# EAGLE design MD201x_2018-11-25 (EAGLE 9.2.2)

## Sheet 1 of 4
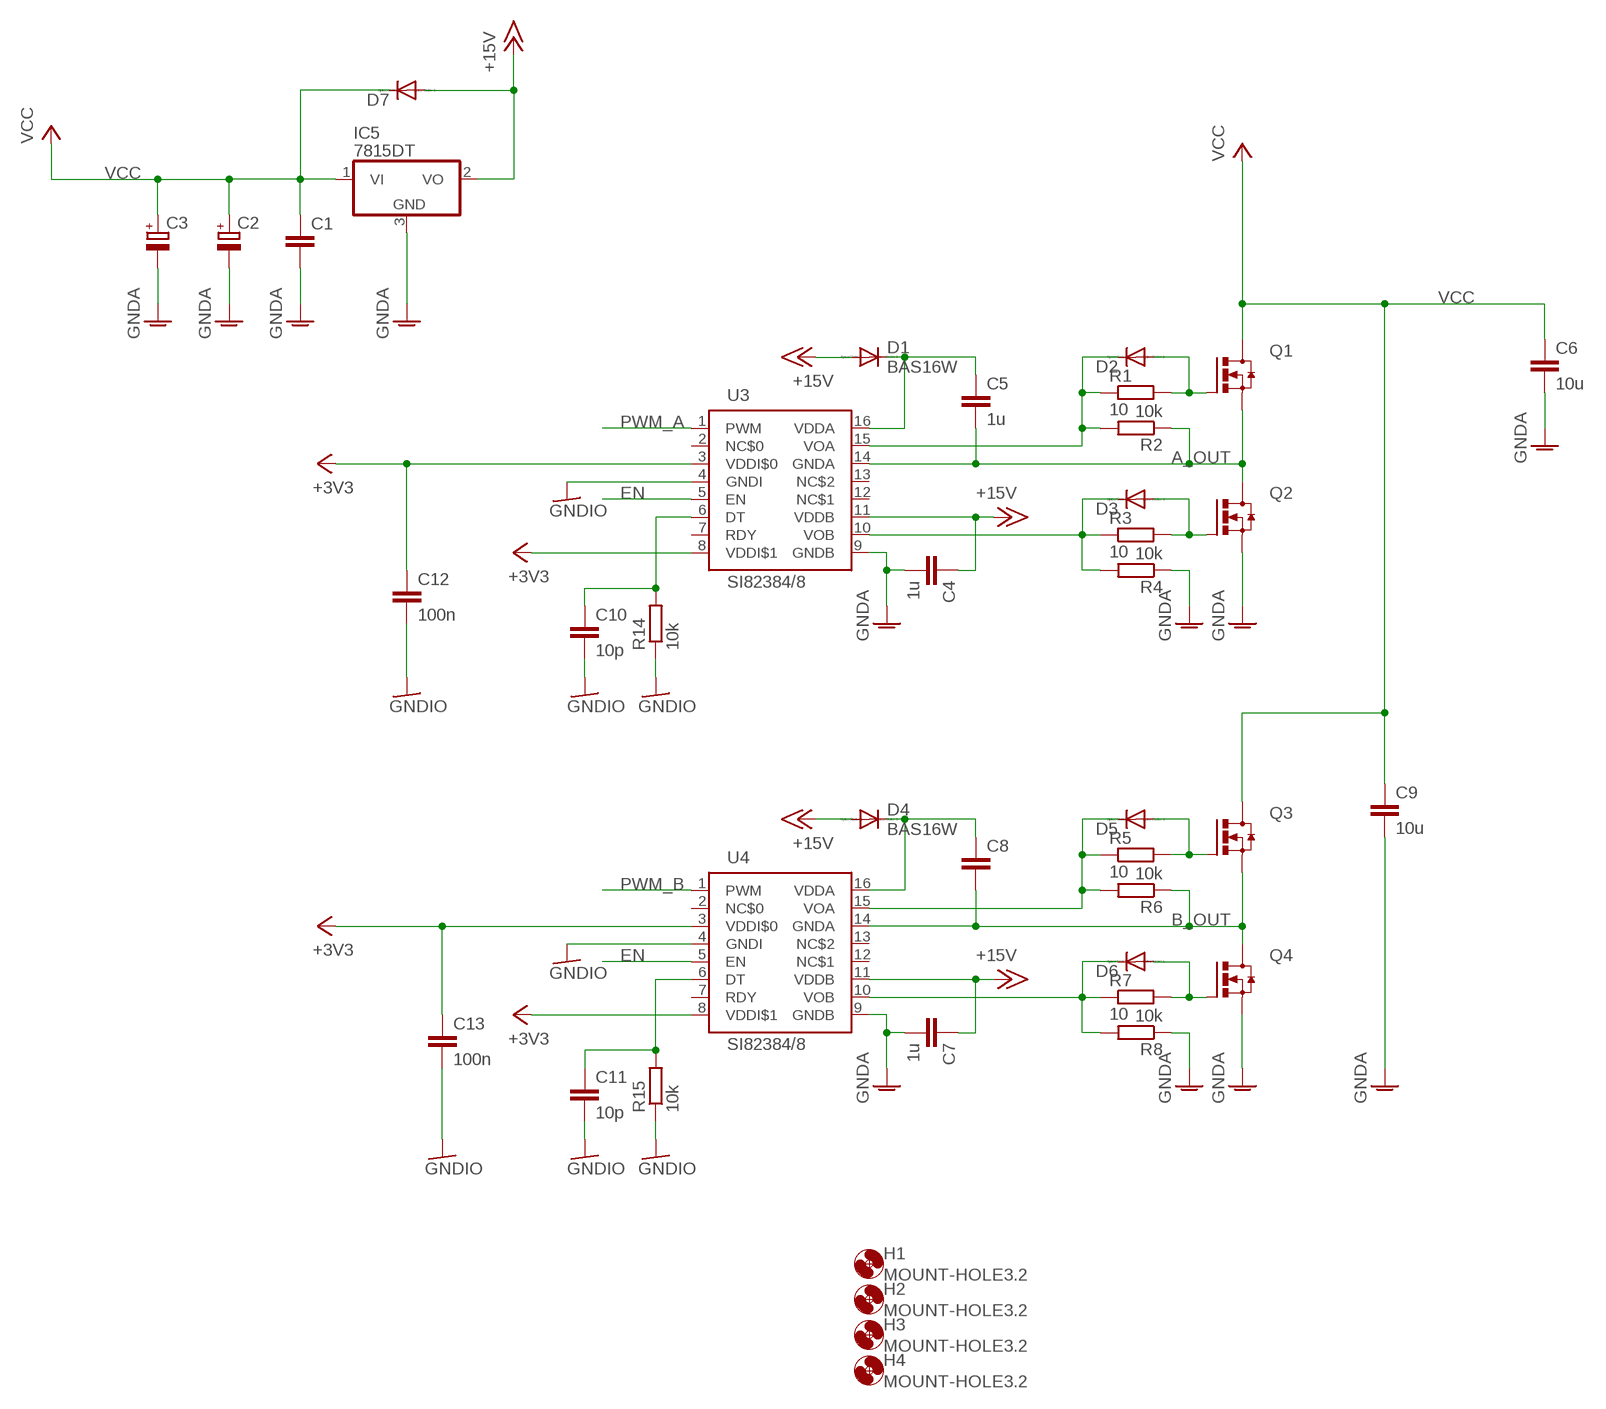
[diagram p0: schematic, sheet 1]

### Parts
C1  C-EUC0805  [C0805]
C2  CPOL-EUE3.5-8  [E3,5-8]
C3  CPOL-EUE3.5-8  [E3,5-8]
C4  1u  C-EUC0805  [C0805]
C5  1u  C-EUC0805  [C0805]
C6  10u  C-EUC1210  [C1210]
C7  1u  C-EUC0805  [C0805]
C8  C-EUC0805  [C0805]
C9  10u  C-EUC1210  [C1210]
C10  10p  C-EUC0603  [C0603]
C11  10p  C-EUC0603  [C0603]
C12  100n  C-EUC0603  [C0603]
C13  100n  C-EUC0603  [C0603]
D1  BAS16W  DIODE-SOD323-R  [SOD323-R]
D2  DIODE-SOD523  [SOD523]
D3  DIODE-SOD523  [SOD523]
D4  BAS16W  DIODE-SOD323-R  [SOD323-R]
D5  DIODE-SOD523  [SOD523]
D6  DIODE-SOD523  [SOD523]
D7  DIODE-SOD323-R  [SOD323-R]
H1  MOUNT-HOLE3.2  [3,2]
H2  MOUNT-HOLE3.2  [3,2]
H3  MOUNT-HOLE3.2  [3,2]
H4  MOUNT-HOLE3.2  [3,2]
IC5  7815DT  [TO252]
Q1  -N_MOSFET-SOT669  [SOT669]
Q2  -N_MOSFET-SOT669  [SOT669]
Q3  -N_MOSFET-SOT669  [SOT669]
Q4  -N_MOSFET-SOT669  [SOT669]
R1  10  R-EU_R0603  [R0603]
R2  10k  R-EU_R0603  [R0603]
R3  10  R-EU_R0603  [R0603]
R4  10k  R-EU_R0603  [R0603]
R5  10  R-EU_R0603  [R0603]
R6  10k  R-EU_R0603  [R0603]
R7  10  R-EU_R0603  [R0603]
R8  10k  R-EU_R0603  [R0603]
R14  10k  R-EU_R0603  [R0603]
R15  10k  R-EU_R0603  [R0603]
U3  SI82384/8  [SOIC16]
U4  SI82384/8  [SOIC16]

### Nets
+3V3: C12.1 C13.1 U3.3(VDDI$0) U3.8(VDDI$1) U4.3(VDDI$0) U4.8(VDDI$1) ; also sheet 3,4
+15V: C4.1 C7.1 D1.A D4.A D7.A IC5.2(VO) U3.11(VDDB) U4.11(VDDB)
A_OUT: C5.2 Q1.1(SOURCE) Q1.2(SOURCE) Q1.3(SOURCE) Q2.5(DRAIN) R2.1 U3.14(GNDA)
B_OUT: C8.2 Q3.1(SOURCE) Q3.2(SOURCE) Q3.3(SOURCE) Q4.5(DRAIN) R6.1 U4.14(GNDA)
EN: U3.5(EN) U4.5(EN) ; also sheet 3
GNDA: C1.2 C2.- C3.- C4.2 C6.2 C7.2 C9.2 IC5.3(GND) Q2.1(SOURCE) Q2.2(SOURCE) Q2.3(SOURCE) Q4.1(SOURCE) Q4.2(SOURCE) Q4.3(SOURCE) R4.1 R8.1 U3.9(GNDB) U4.9(GNDB)
GNDIO: C10.2 C11.2 C12.2 C13.2 R14.1 R15.1 U3.4(GNDI) U4.4(GNDI) ; also sheet 2,3,4
N$1: D2.C R1.1 R2.2 U3.15(VOA)
N$2: D5.C R5.1 R6.2 U4.15(VOA)
N$4: D2.A Q1.4(GATE) R1.2
N$5: D6.C R7.1 R8.2 U4.10(VOB)
N$6: C10.1 R14.2 U3.6(DT)
N$9: C11.1 R15.2 U4.6(DT)
N$11: D3.C R3.1 R4.2 U3.10(VOB)
N$13: D5.A Q3.4(GATE) R5.2
N$61: D3.A Q2.4(GATE) R3.2
N$64: D6.A Q4.4(GATE) R7.2
N$67: C8.1 D4.C U4.16(VDDA)
N$73: C5.1 D1.C U3.16(VDDA)
PWM_A: U3.1(PWM) ; also sheet 3
PWM_B: U4.1(PWM) ; also sheet 3
VCC: C1.1 C2.+ C3.+ C6.1 C9.1 D7.C IC5.1(VI) Q1.5(DRAIN) Q3.5(DRAIN)
Unconnected: U3.2(NC$0) U3.7(RDY) U3.12(NC$1) U3.13(NC$2) U4.2(NC$0) U4.7(RDY) U4.12(NC$1) U4.13(NC$2)

## Sheet 2 of 4
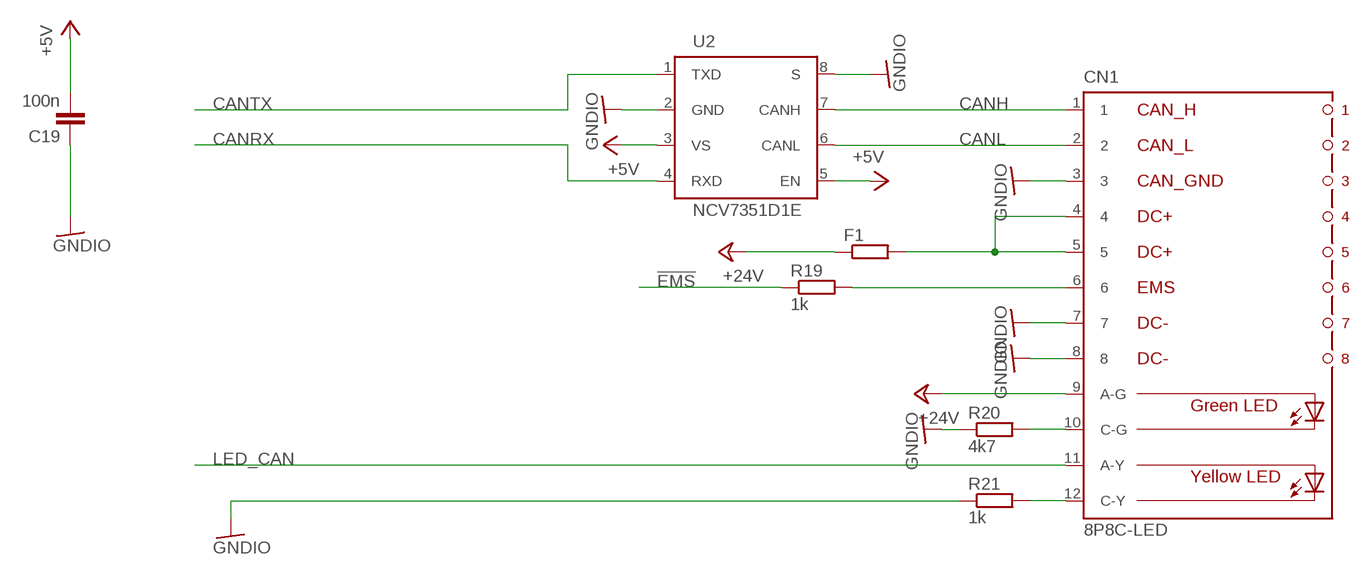
[diagram p1: schematic, sheet 2]

### Parts
C19  100n  C-EUC0603  [C0603]
CN1  8P8C-LED  [8P8C-LED]
F1  R-EU_R1206  [R1206]
R19  1k  R-EU_R0603  [R0603]
R20  4k7  R-EU_R0603  [R0603]
R21  1k  R-EU_R0603  [R0603]
U2  NCV7351D1E  [SO08]

### Nets
!EMS: R19.1 ; also sheet 3
!EMS_ISO: CN1.6 R19.2
+5V: C19.2 U2.3(VS) U2.5(EN) ; also sheet 3,4
+24V: CN1.9(A-G) F1.1 ; also sheet 4
CANH: CN1.1 U2.7(CANH)
CANL: CN1.2 U2.6(CANL)
CANRX: U2.4(RXD) ; also sheet 3
CANTX: U2.1(TXD) ; also sheet 3
GNDIO: C19.1 CN1.3 CN1.7 CN1.8 R20.1 R21.1 U2.2(GND) U2.8(S) ; also sheet 1,3,4
LED_CAN: CN1.11(A-Y) ; also sheet 3
N$8: CN1.4 CN1.5 F1.2
N$18: CN1.10(C-G) R20.2
N$20: CN1.12(C-Y) R21.2

## Sheet 3 of 4
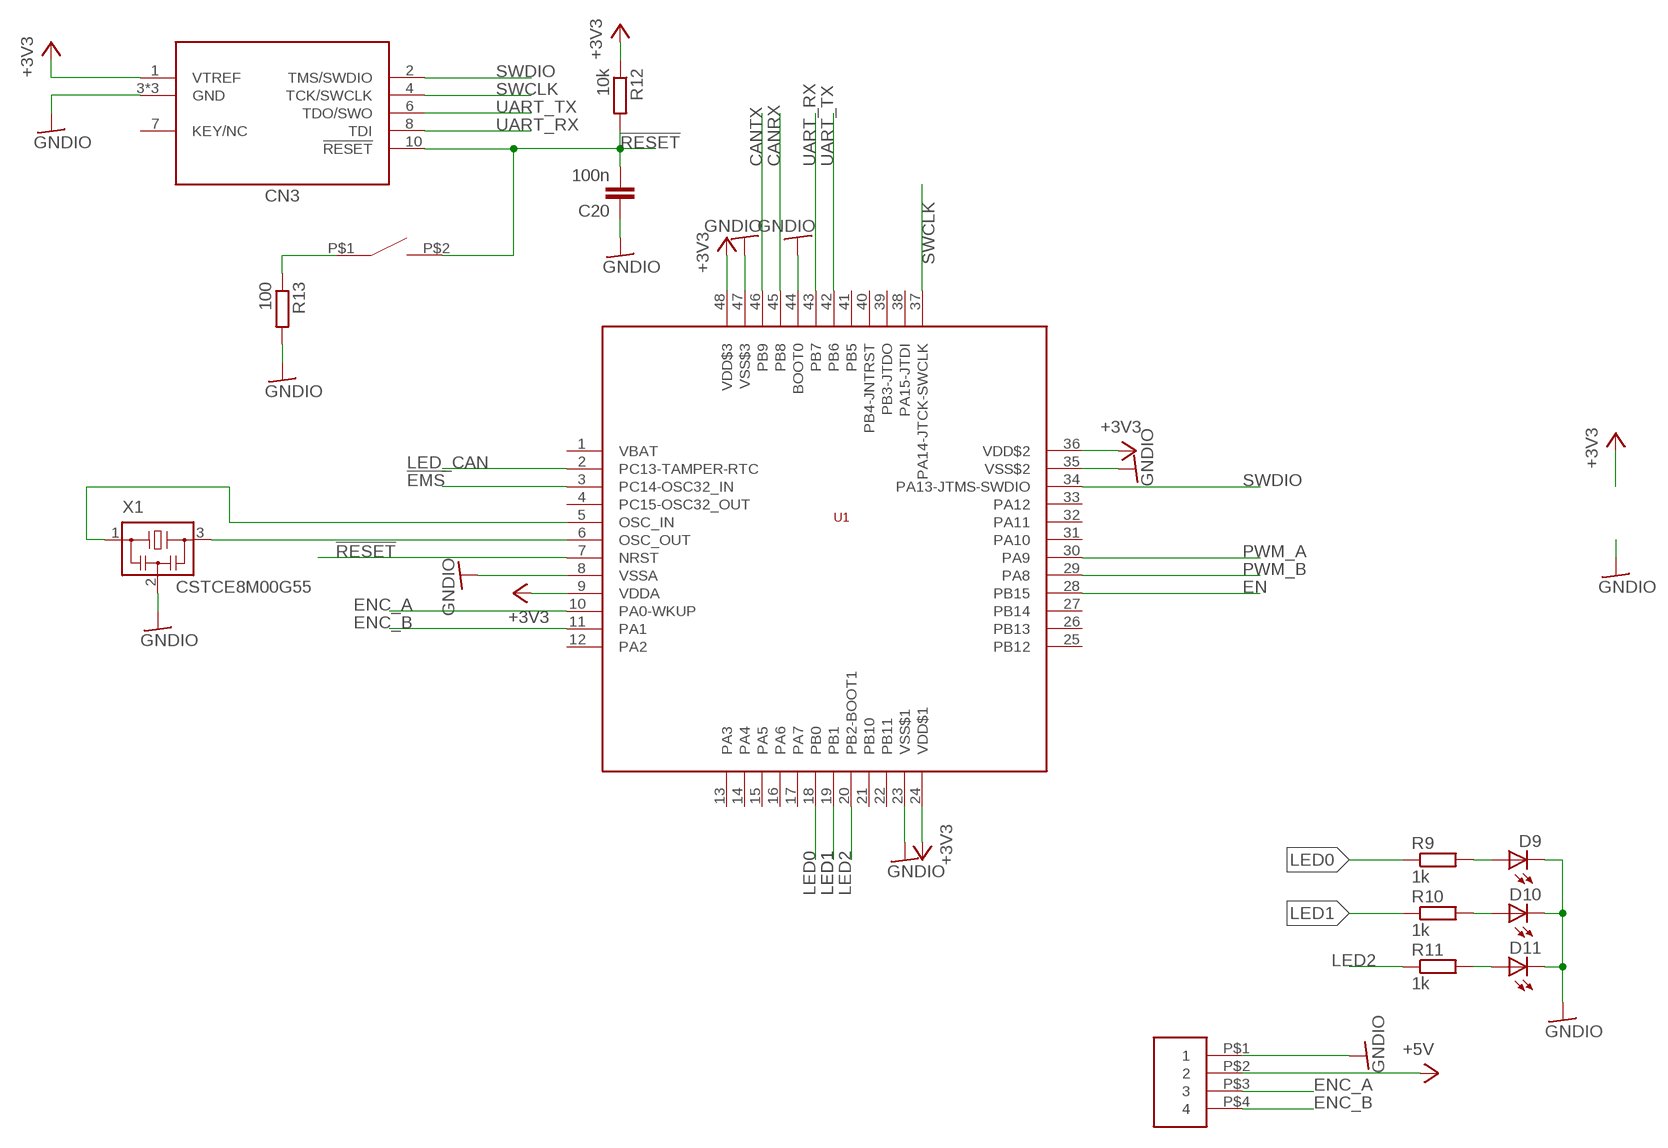
[diagram p2: schematic, sheet 3]

### Parts
C20  100n  C-EUC0603  [C0603]
CN2  XH-4-SIDE  [CON-XH-4-SIDE]
CN3  CON_SWD_1.27_SMD  [CON_SWD_1.27_SMD]
D9  LEDCHIPLED_0805  [CHIPLED_0805]
D10  LEDCHIPLED_0805  [CHIPLED_0805]
D11  LEDCHIPLED_0805  [CHIPLED_0805]
R9  1k  R-EU_R0603  [R0603]
R10  1k  R-EU_R0603  [R0603]
R11  1k  R-EU_R0603  [R0603]
R12  10k  R-EU_R0603  [R0603]
R13  100  R-EU_R0603  [R0603]
SW1  SWITCH_TACTILETOP  [SWITCH_TACTILE_3X6]
U1  STM32F103C8  [LQFP48]
X1  CSTCE8M00G55  [CSTCE8M00G55]

### Nets
!EMS: U1.3(PC14-OSC32_IN) ; also sheet 2
!RESET: C20.2 CN3.10(!RESET) R12.2 SW1.P$2 U1.7(NRST)
+3V3: CN3.1(VTREF) R12.1 U1.9(VDDA) U1.24(VDD$1) U1.36(VDD$2) U1.48(VDD$3) ; also sheet 1,4
+5V: CN2.P$2 ; also sheet 2,4
CANRX: U1.45(PB8) ; also sheet 2
CANTX: U1.46(PB9) ; also sheet 2
EN: U1.28(PB15) ; also sheet 1
ENC_A: CN2.P$3 U1.10(PA0-WKUP)
ENC_B: CN2.P$4 U1.11(PA1)
GNDIO: C20.1 CN2.P$1 CN3.3(GND) CN3.5(GND) CN3.9(GND) D9.C D10.C D11.C R13.2 U1.8(VSSA) U1.23(VSS$1) U1.35(VSS$2) U1.44(BOOT0) U1.47(VSS$3) X1.2 ; also sheet 1,2,4
LED0: R9.1 U1.18(PB0)
LED1: R10.1 U1.19(PB1)
LED2: R11.1 U1.20(PB2-BOOT1)
LED_CAN: U1.2(PC13-TAMPER-RTC) ; also sheet 2
N$3: D10.A R10.2
N$7: D9.A R9.2
N$10: U1.6(OSC_OUT) X1.3
N$16: R13.1 SW1.P$1
N$19: U1.5(OSC_IN) X1.1
N$21: D11.A R11.2
PWM_A: U1.30(PA9) ; also sheet 1
PWM_B: U1.29(PA8) ; also sheet 1
SWCLK: CN3.4(TCK/SWCLK) U1.37(PA14-JTCK-SWCLK)
SWDIO: CN3.2(TMS/SWDIO) U1.34(PA13-JTMS-SWDIO)
UART_RX: CN3.8(TDI) U1.43(PB7)
UART_TX: CN3.6(TDO/SWO) U1.42(PB6)
Unconnected: CN3.7(KEY/NC) U1.1(VBAT) U1.4(PC15-OSC32_OUT) U1.12(PA2) U1.13(PA3) U1.14(PA4) U1.15(PA5) U1.16(PA6) U1.17(PA7) U1.21(PB10) U1.22(PB11) U1.25(PB12) U1.26(PB13) U1.27(PB14) U1.31(PA10) U1.32(PA11) U1.33(PA12) U1.38(PA15-JTDI) U1.39(PB3-JTDO) U1.40(PB4-JNTRST) U1.41(PB5)

## Sheet 4 of 4
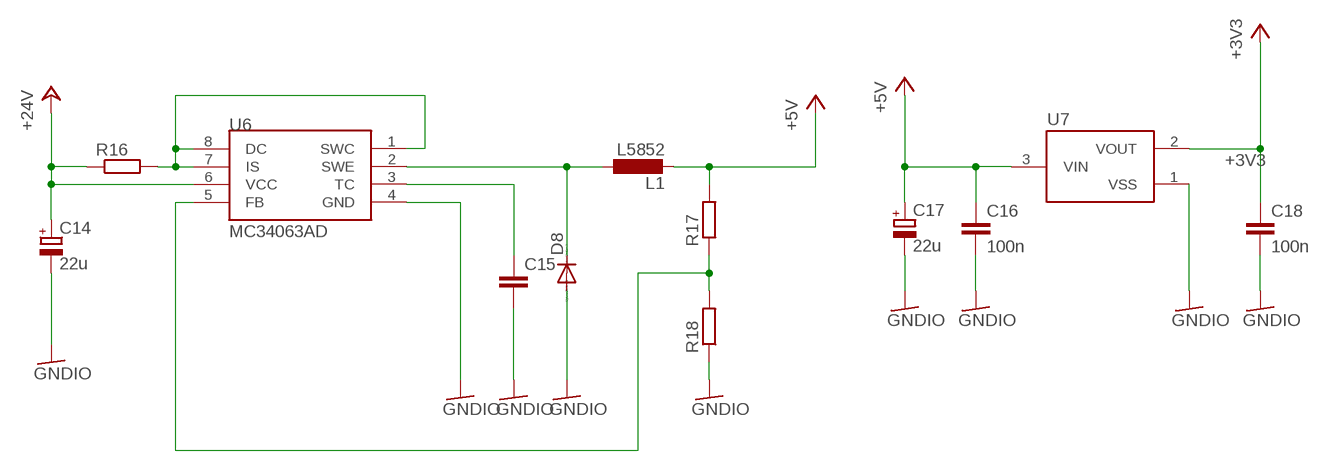
[diagram p3: schematic, sheet 4]

### Parts
C14  22u  CPOL-EUE2-5  [E2-5]
C15  C-EUC0603  [C0603]
C16  100n  C-EUC0603  [C0603]
C17  22u  CPOL-EUE2-5  [E2-5]
C18  100n  C-EUC0603  [C0603]
D8  DIODE-SOD123  [SOD123]
L1  L5852  [L5852]
R16  R-EU_R1206  [R1206]
R17  R-EU_R0603  [R0603]
R18  R-EU_R0603  [R0603]
U6  MC34063AD  [SOIC8]
U7  XC6206  [SOT95P240X110-3]

### Nets
+3V3: C18.1 U7.2(VOUT) ; also sheet 1,3
+5V: C16.1 C17.+ L1.P$2 R17.2 U7.3(VIN) ; also sheet 2,3
+24V: C14.+ R16.1 U6.6(VCC) ; also sheet 2
GNDIO: C14.- C15.2 C16.2 C17.- C18.2 D8.A R18.1 U6.4(GND) U7.1(VSS) ; also sheet 1,2,3
N$12: R16.2 U6.1(SWC) U6.7(IS) U6.8(DC)
N$14: D8.C L1.P$1 U6.2(SWE)
N$15: C15.1 U6.3(TC)
N$17: R17.1 R18.2 U6.5(FB)

## Library data of the parts
C1 C4-C13 C16 C18-C20 = rcl:C-EU: CAPACITOR, European symbol
C2 C3 C14 C17 = rcl:CPOL-EU: POLARIZED CAPACITOR, European symbol
C15 = rcl:C-EU: CAPACITOR, European symbol; SPICEPREFIX: C
CN1 = con-rj45:8P8C-LED: generic 8P8C connector with two LED's; OC_FARNELL: unknown; OC_NEWARK: unknown
CN2 = con-xh:XH-4-SIDE
CN3 = con-swd:CON_SWD_1.27_SMD
D1-D8 = diode:DIODE-: DIODE
D9-D11 = led:LED: LED OSRAM: - CHIPLED LG R971, LG N971, LY N971, LG Q971, LY Q971, LO R971, LY R971 LH N974, LH R974 LS Q976, LO Q976, LY Q976 LO Q996 - Hyper CHIPLED LW Q18S LB Q993, LB Q99A, LB R99A - SideLED LS A670, LO A670, LY A670, LG A670, LP A670 LB A673, LV A673, LT A673, LW A673 LH A674 LY A675 LS A676, LA A676, LO A676, LY A676, LW A676 LS A679, LY A679, LG A679 - Hyper Micro SIDELED® LS Y876, LA Y876, LO Y876, LY Y876 LT Y87S - SmartLED LW L88C, LW L88S LB L89C, LB L89S, LG L890 LS L89K, LO L89K, LY L89K LS L896, LA L896, LO L896, LY L896 - TOPLED LS T670, LO T670, LY T670, LG T670, LP T670 LSG T670, LSP T670, LSY T670, LOP T670, LYG T670 LG T671, LOG T671, LSG T671 LB T673, LV T673, LT T673, LW T673 LH T674 LS T676, LA T676, LO T676, LY T676, LB T676, LH T676, LSB T676, LW T676 LB T67C, LV T67C, LT T67C, LS T67K, LO T67K, LY T67K, LW E67C LS E67B, LA E67B, LO E67B, LY E67B, LB E67C, LV E67C, LT E67C LW T67C LS T679, LY T679, LG T679 LS T770, LO T770, LY T770, LG T770, LP T770 LB T773, LV T773, LT T773, LW T773 LH T774 LS E675, LA E675, LY E675, LS T675 LS T776, LA T776, LO T776, LY T776, LB T776 LHGB T686 LT T68C, LB T68C - Hyper Mini TOPLED® LB M676 - Mini TOPLED Santana® LG M470 LS M47K, LO M47K, LY M47K Source: http://www.osram.convergy.de LUXEON: - LUMILED® LXK2-PW12-R00, LXK2-PW12-S00, LXK2-PW14-U00, LXK2-PW14-V00 LXK2-PM12-R00, LXK2-PM12-S00, LXK2-PM14-U00 LXK2-PE12-Q00, LXK2-PE12-R00, LXK2-PE12-S00, LXK2-PE14-T00, LXK2-PE14-U00 LXK2-PB12-K00, LXK2-PB12-L00, LXK2-PB12-M00, LXK2-PB14-N00, LXK2-PB14-P00, LXK2-PB14-Q00 LXK2-PR12-L00, LXK2-PR12-M00, LXK2-PR14-Q00, LXK2-PR14-R00 LXK2-PD12-Q00, LXK2-PD12-R00, LXK2-PD12-S00 LXK2-PH12-R00, LXK2-PH12-S00 LXK2-PL12-P00, LXK2-PL12-Q00, LXK2-PL12-R00 Source: www.luxeon.com KINGBRIGHT: KA-3528ASYC Source: www.kingbright.com
F1 R16-R21 = rcl:R-EU_: RESISTOR, European symbol; SPICEPREFIX: R
H1-H4 = holes:MOUNT-HOLE: MOUNTING HOLE with drill center marker
IC5 = linear:78*: Positive VOLTAGE REGULATOR Source: http://cache.national.com/ds/LM/LM78L05.pdf http://www.fairchildsemi.com/ds/LM/LM7805.pdf
L1 = l_ysk:L5852
Q1-Q4 = transistor:*-N_MOSFET-
R1-R15 = rcl:R-EU_: RESISTOR, European symbol
SW1 = switch-tactile:SWITCH_TACTILE
U1 = stm32_mcu:STM32F103C8: STMicroelectronics STM32F103C8 Mainstream Performance line, ARM Cortex-M3 MCU with 64 Kbytes Flash, 72 MHz CPU, motor control, USB and CAN references: datasheet <https://www.st.com/resource/en/datasheet/stm32f103c8.pdf> product page <https://www.st.com/ja/microcontrollers/stm32f103c8.html>
U2 = on-semi:NCV7351D1E: High Speed CAN Transceiver Source: NCV7351-D.PDF <http://www.onsemi.com/PowerSolutions/document/NCV7351-D.PDF>
U3 U4 = silabs:SI82384/8
U6 = mc34063:MC34063
U7 = torex:XC6206
X1 = resonator:CSTCE8M00G55

## Board
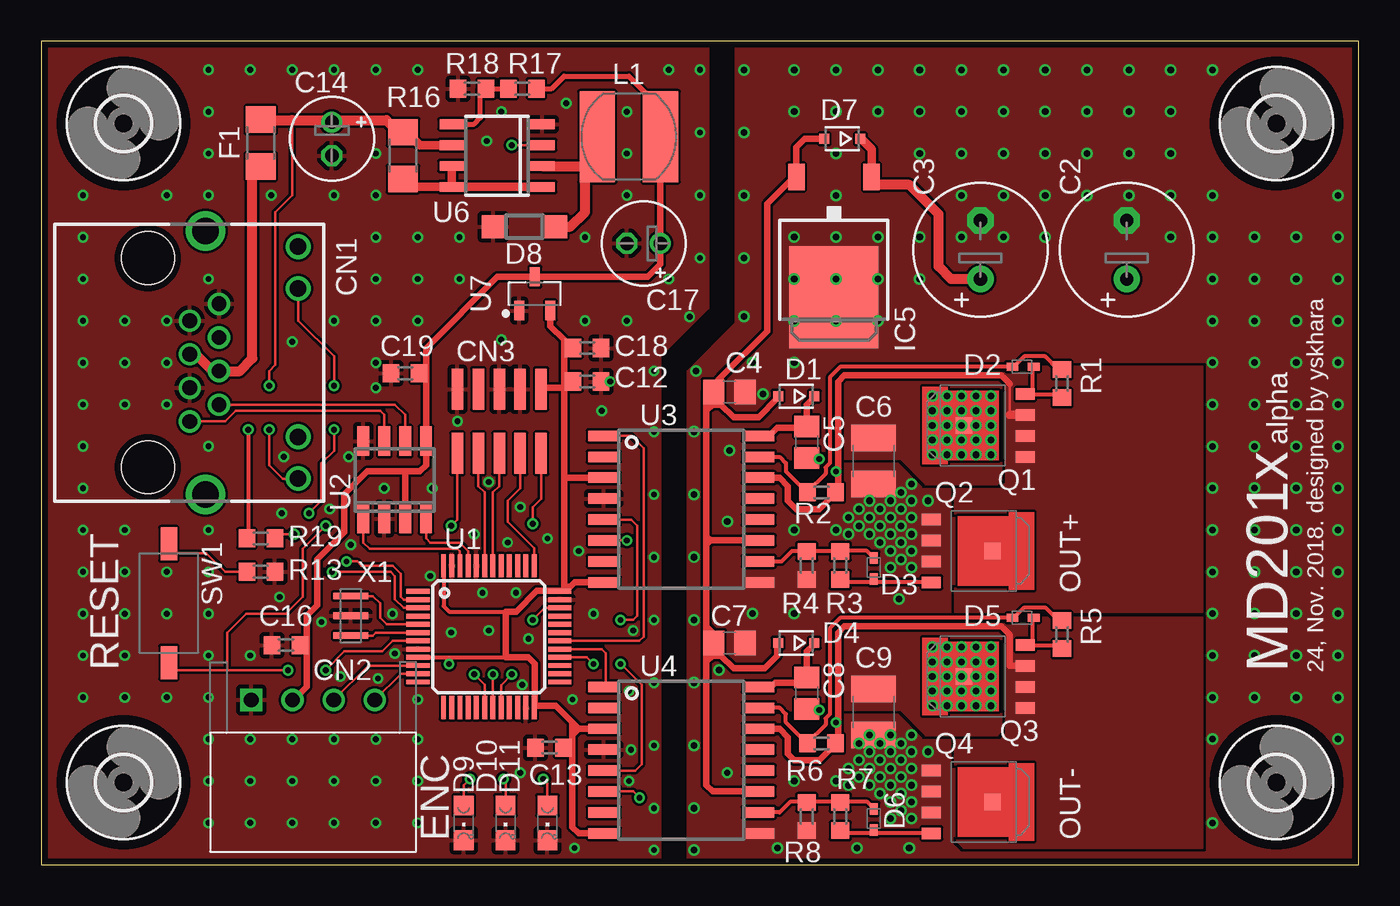
[diagram p4: board, top side]
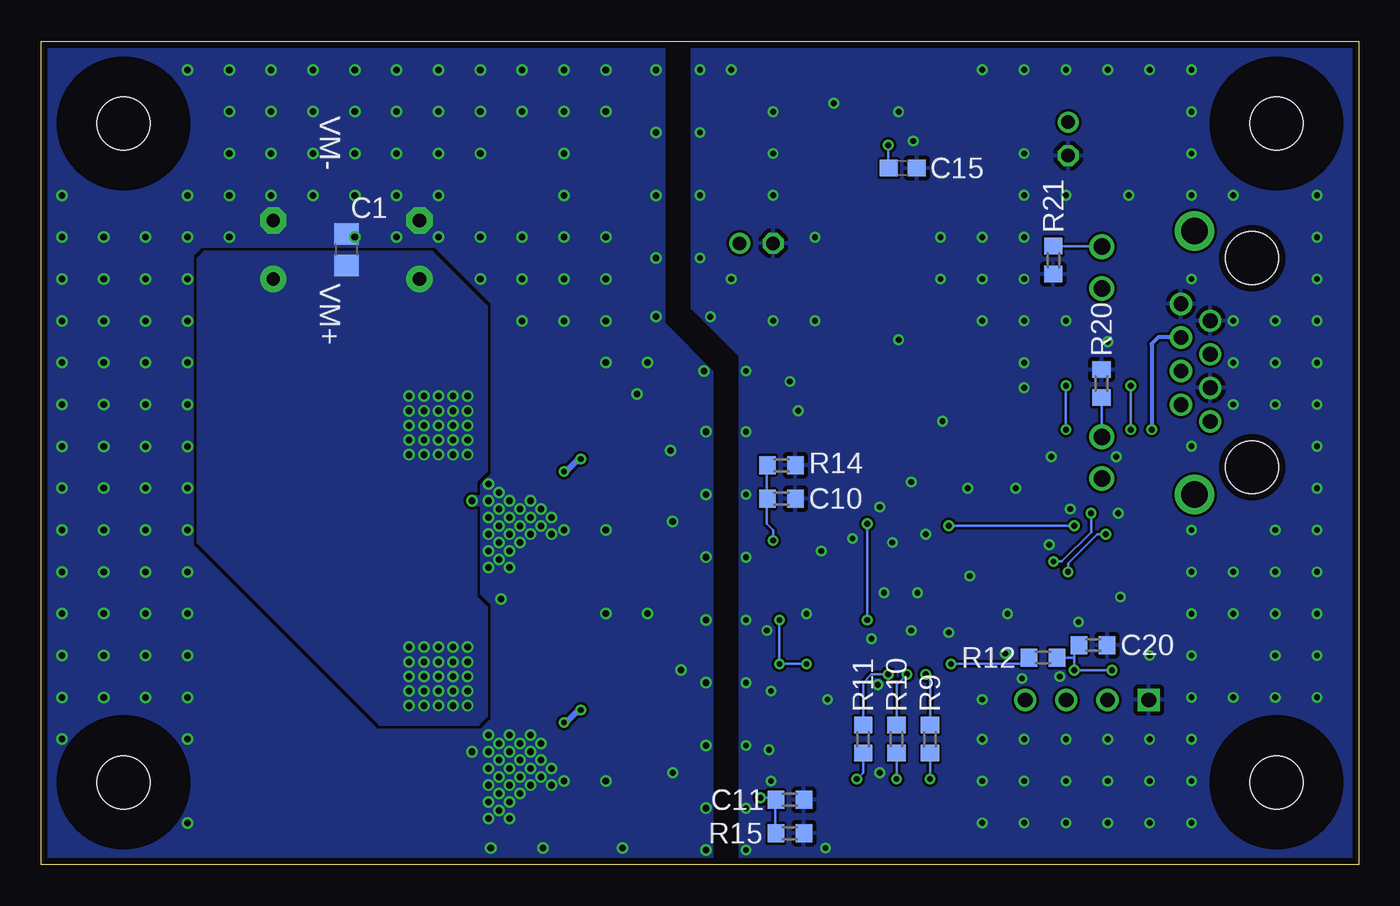
[diagram p5: board, bottom side, seen from below]

Size 80 x 50 mm. Coordinates in mm from the lower left corner, seen from the top.
Outline: 0,0 80,0 80,50 0,50 0,0
Copper layers (1*16): Top 0.035mm / dielectric 1.5mm / Bottom 0.035mm
Design rules "seeed_2layers": minimum track width 6mil, minimum drill 0.2mm, track to track 6mil, track to pad 6mil, pad to pad 6mil, via to via 6mil, smd to smd 0mil, copper to edge 0.4mm, drill to drill 12mil, minimum pad ring 0.15mm, minimum via ring 0.15mm, stop-mask expansion 4mil, vias tented up to drill 0mil, thermal gap 10mil

### Footprints (pad centres in the part's own frame; a part is rotated, then mirrored left to right if it is on the bottom)
C0805 = smd 1.3 x 1.5: 1 -0.95,0; 2 0.95,0
E3,5-8 = drill 0.813 pad 1.6: + -1.778,0 | drill 0.813 pad 1.6 octagon: - 1.778,0
C1210 = smd 1.6 x 2.7: 1 -1.4,0; 2 1.4,0
C0603 = smd 1 x 1.1: 1 -0.85,0; 2 0.85,0
E2-5 = drill 0.813 pad 1.27: + -1.016,0 | drill 0.813 pad 1.27 octagon: - 1.016,0
C0603' = smd 1.1 x 1: 1 -0.85,0; 2 0.85,0
8P8C-LED = drill 0.9 pad 1.3: 1 3.57,-3.81; 2 2.55,-2.03; 3 1.53,-3.81; 4 0.51,-2.03; 5 -0.51,-3.81; 6 -1.53,-2.03; 7 -2.55,-3.81; 8 -3.57,-2.03 | drill 1 pad 1.422: 9 7.04,2.78; 10 4.5,2.78; 11 -4.5,2.78; 12 -7.04,2.78 | drill 1.6 pad 2.184: M1 -8,-2.85; M2 8,-2.85 | hole 3.2: 6.35,-6.35; -6.35,-6.35
CON-XH-4-SIDE = drill 0.9 square: P$1 3.75,-2 | drill 0.9: P$2 1.25,-2; P$3 -1.25,-2; P$4 -3.75,-2
CON_SWD_1.27_SMD = smd 0.7 x 2.5: 1 2.54,1.95; 2 2.54,-1.95; 3 1.27,1.95; 4 1.27,-1.95; 5 0,1.95; 6 0,-1.95; 7 -1.27,1.95; 8 -1.27,-1.95; 9 -2.54,1.95; 10 -2.54,-1.95
SOD323-R = smd 0.6 x 0.6: A 1.1,0; C -1.1,0
SOD523 = smd 0.7 x 0.5: A 0.7,0; C -0.6,0
SOD123 = smd 1.4 x 1.4: A 1.9,0; C -1.9,0
CHIPLED_0805 = smd 1.2 x 1.2: A 0,-1.05; C 0,1.05
R1206 = smd 1.6 x 1.803: 1 -1.422,0; 2 1.422,0
3,2 = hole 3.2: 0,0
TO252 = smd 1 x 1.6: 1 -2.28,-4.8; 2 2.28,-4.8 | smd 5.4 x 6.2: 3 0,2.5
L5852 = smd 2.15 x 5.5: P$1 1.925,0; P$2 -1.925,0
SOT669 = smd 1.15 x 0.7: 1 -2.725,1.905; 2 -2.725,0.635; 3 -2.725,-0.635; 4 -2.725,-1.905 | smd 1 x 1: 5 1,0
R0603 = smd 1 x 1.1: 1 -0.85,0; 2 0.85,0
SWITCH_TACTILE_3X6 = smd 2 x 1: P$1 -3.6,0; P$2 3.6,0
LQFP48 = smd 1.4 x 0.3: 1 -4.3,2.75; 2 -4.3,2.25; 3 -4.3,1.75; 4 -4.3,1.25; 5 -4.3,0.75; 6 -4.3,0.25; 7 -4.3,-0.25; 8 -4.3,-0.75; 9 -4.3,-1.25; 10 -4.3,-1.75; 11 -4.3,-2.25; 12 -4.3,-2.75; 25 4.3,-2.75; 26 4.3,-2.25; 27 4.3,-1.75; 28 4.3,-1.25; 29 4.3,-0.75; 30 4.3,-0.25; 31 4.3,0.25; 32 4.3,0.75; 33 4.3,1.25; 34 4.3,1.75; 35 4.3,2.25; 36 4.3,2.75 | smd 0.3 x 1.4: 13 -2.75,-4.3; 14 -2.25,-4.3; 15 -1.75,-4.3; 16 -1.25,-4.3; 17 -0.75,-4.3; 18 -0.25,-4.3; 19 0.25,-4.3; 20 0.75,-4.3; 21 1.25,-4.3; 22 1.75,-4.3; 23 2.25,-4.3; 24 2.75,-4.3; 37 2.75,4.3; 38 2.25,4.3; 39 1.75,4.3; 40 1.25,4.3; 41 0.75,4.3; 42 0.25,4.3; 43 -0.25,4.3; 44 -0.75,4.3; 45 -1.25,4.3; 46 -1.75,4.3; 47 -2.25,4.3; 48 -2.75,4.3
SO08 = smd 0.72 x 1.78: 1 -1.905,-2.35; 2 -0.635,-2.35; 3 0.635,-2.35; 4 1.905,-2.35; 5 1.905,2.35; 6 0.635,2.35; 7 -0.635,2.35; 8 -1.905,2.35
SOIC16 = smd 0.635 x 1.9: 1 -4.445,-4.7; 2 -3.175,-4.7; 3 -1.905,-4.7; 4 -0.635,-4.7; 5 0.635,-4.7; 6 1.905,-4.7; 7 3.175,-4.7; 8 4.445,-4.7; 9 4.445,4.7; 10 3.175,4.7; 11 1.905,4.7; 12 0.635,4.7; 13 -0.635,4.7; 14 -1.905,4.7; 15 -3.175,4.7; 16 -4.445,4.7
SOIC8 = smd 0.6 x 1.5: 1 -1.905,-2.75; 2 -0.635,-2.75; 3 0.635,-2.75; 4 1.905,-2.75; 5 1.905,2.75; 6 0.635,2.75; 7 -0.635,2.75; 8 -1.905,2.75
SOT95P240X110-3 = smd 1.18 x 0.609: 1 -1.024,0.95; 2 -1.024,-0.95; 3 1.024,0
CSTCE8M00G55 = smd 0.4 x 2.1: 1 -1.2,0; 2 0,0; 3 1.2,0

### Placement (x,y rotation side)
C1  61.47,37.34 90 bottom
C2  65.91,37.34 90 top
C3  57.02,37.34 90 top
C4  41.78,28.7 0 top
C5  46.48,25.65 270 top
C6  50.55,24.51 270 top
C7  41.78,13.46 0 top
C8  46.48,10.41 270 top
C9  50.55,9.27 270 top
C10  35.05,22.23 0 bottom
C11  34.54,3.94 0 bottom
C12  33.15,29.34 0 top
C13  30.86,7.11 180 top
C14  17.65,44.07 270 top
C15  [C0603']  27.69,42.29 0 bottom
C16  14.86,13.34 180 top
C17  36.58,37.72 180 top
C18  33.15,31.37 0 top
C19  22.1,29.84 0 top
C20  16.13,13.34 180 bottom
CN1  12.83,30.48 270 top
CN2  16.51,8 180 top
CN3  27.81,26.92 0 top
D1  45.85,28.45 180 top
D2  59.56,30.23 0 top
D3  50.55,18.03 270 top
D4  45.85,13.46 180 top
D5  59.56,14.99 0 top
D6  50.55,2.79 270 top
D7  48.64,44.07 180 top
D8  29.34,38.73 180 top
D9  25.65,2.54 180 top
D10  28.19,2.54 180 top
D11  30.73,2.54 180 top
F1  13.34,43.81 270 top
H1  75,45 0 top
H2  75,5 0 top
H3  5,45 0 top
H4  5,5 0 top
IC5  48.13,36.96 180 top
L1  35.69,44.2 180 top
Q1  57.02,26.67 180 top
Q2  56.77,19.05 0 top
Q3  57.02,11.43 180 top
Q4  56.77,3.81 0 top
R1  61.98,29.21 270 top
R2  47.37,22.61 180 top
R3  48.51,18.16 270 top
R4  46.48,18.16 90 top
R5  61.98,13.97 270 top
R6  47.37,7.37 180 top
R7  48.51,2.92 270 top
R8  46.48,2.92 90 top
R9  26.04,7.62 270 bottom
R10  28.07,7.62 270 bottom
R11  30.1,7.62 270 bottom
R12  19.18,12.57 0 bottom
R13  13.34,17.78 0 top
R14  35.05,24.26 180 bottom
R15  34.54,1.91 180 bottom
R16  21.97,43.05 270 top
R17  29.21,47.12 0 top
R18  26.16,47.12 0 top
R19  13.34,19.81 180 top
R20  15.62,29.21 270 bottom
R21  18.54,36.7 90 bottom
SW1  7.75,15.88 270 top
U1  27.18,13.84 0 top
U2  21.46,23.37 0 top
U3  38.86,21.59 270 top
U4  38.86,6.35 270 top
U6  27.69,43.05 90 top
U7  29.97,34.67 90 top
X1  18.8,15.11 270 top

### Tracks (layer width: path | path; a pad name or v marks a point on that pad's centre or on a via)
!EMS  (via drill 0.35)
  Top 0.152: U1.3 22,15.59 21.46,16.13 21.46,17.53 21.21,17.78 v17.65,17.78 | v15.37,20.07 14.22,20.07 R19.1
  Bottom 0.152: v17.65,17.78 17.65,18.29 15.88,20.07 v15.37,20.07
!EMS_ISO  (via drill 0.35)
  Top 0.254: v12.57,26.42 12.57,19.81 R19.2
  Bottom 0.254: CN1.6 12.19,32.01 12.57,31.62 v12.57,26.42
!RESET  (via drill 0.35)
  Top 0.152: v14.99,11.81 11.3,11.81 | 11.3,11.81 7.75,11.81 SW1.P$2 | v17.27,11.81 18.41,12.95 20.7,12.95 21.34,13.59 U1.7 | CN3.10 25.27,20.95 v24.89,20.57 | v17.27,20.57 15.88,19.18 15.88,16.26 14.86,15.24 12.45,15.24 11.3,14.1 11.3,11.81
  Bottom 0.152: v14.99,11.81 v17.27,11.81 17.27,12.57 | 18.29,12.57 R12.2 17.27,12.57 | v24.89,20.57 v17.27,20.57 | 17.27,12.57 17.27,13.34 C20.2
+3V3  (via drill 0.35)
  Top 0.152: v24.77,12.19 24.79,12.59
  Top 0.254: U1.48 24.43,15.7 24.77,15.37 28.19,15.37 | 28.83,15.37 28.7,15.37 | U1.9 24.79,12.59 28.19,12.59 28.32,12.59 | 31.75,16.64 31.29,16.59 U1.36 | U1.24 29.97,9.59 29.97,9.65
  Top 0.305: 31.75,23.37 31.75,23.5 31.75,28.96
  Top 0.406: 28.83,15.37 30.1,16.64 31.75,16.64 31.75,16.89 | 28.7,15.37 28.19,15.37 28.19,12.59 | 28.32,12.59 29.57,12.59 29.97,12.19 29.97,9.65 31.24,9.65 32.26,8.64 | U4.3 32.64,8.26 | 32.64,8.26 32.26,8.64 | U4.8 32.64,1.91 32.26,2.29 32.26,6.99 | 32.26,7.87 32.26,8.64 | U3.3 31.75,23.5 | C13.1 32.13,7.11 32.26,6.99 | 32.64,8.26 32.26,7.87 | 32.26,7.87 32.26,6.99 | U3.8 32.38,17.14 32.13,16.89 31.75,16.89 | 31.75,31.37 31.75,31.88 30.92,32.7 U7.2 | 31.75,31.37 31.75,29.34 | 31.75,29.34 31.75,28.96 | 31.75,28.96 30.35,28.96 CN3.1 | 31.75,28.96 31.75,23.37 31.75,16.89 | C18.1 31.75,31.37 | C12.1 31.75,29.34
  Bottom 0.152: R12.1 20.07,12.19 v24.77,12.19
+5V
  Top 0.305: R17.2 30.99,47.12 31.75,47.88 35.69,47.88 37.59,45.97 37.59,44.22 | 37.59,44.2 37.59,44.22 | 37.59,44.22 L1.P$2
  Top 0.406: U2.3 22.1,23.88 | 22.1,23.88 22.99,23.88 23.37,24.26 U2.5 23.37,29.84 | CN2.P$2 15.24,9.91 16.13,10.79 16.13,13.34 | 22.1,23.88 19.81,23.88 18.41,22.48 18.41,20.19 16.76,18.54 16.76,15.75 16.13,15.11 16.13,13.34 | 23.37,29.84 23.37,31.37 27.69,35.69 29.97,35.69 | 29.97,35.69 36.83,35.69 37.59,36.45 C17.+ 37.59,44.2 | C19.2 23.37,29.84 | C16.1 16.13,13.34 | U7.3 29.97,35.69
+15V
  Top 0.406: U3.11 40.64,19.68 | 40.64,19.68 40.39,19.94 | 40.39,27.56 40.39,19.94 | D1.A 44.7,28.32 43.56,27.18 42.04,27.18 41.27,27.94 | 41.27,27.94 41.02,28.19 41.02,28.7 | 40.39,19.94 40.39,19.43 | 40.39,13.46 40.39,12.7 | 40.39,12.7 40.39,12.32 | 40.39,12.32 40.39,4.83 40.77,4.45 U4.11 | 40.64,19.68 40.39,19.43 | D4.A 44.7,13.46 44.7,12.7 43.94,11.94 42.04,11.94 41.27,12.7 40.77,12.7 | 40.77,12.7 40.39,12.7 | 40.39,13.46 C7.1 40.83,14.03 40.39,14.48 | 40.39,13.46 40.39,14.48 | 40.39,14.48 40.39,19.43 | 40.39,27.56 40.39,28.7 C4.1 40.89,28.7 | 40.89,28.7 41.02,28.7 | 41.02,28.7 41.27,28.7 41.27,29.59 | 41.27,29.59 44.07,32.38 44.07,40.13 45.47,41.53 45.59,41.53 IC5.2 45.85,43.57 46.35,44.07 D7.A | 40.39,27.56 40.77,27.94 41.27,27.94 | 40.77,12.7 40.39,12.32 | 41.27,29.59 40.89,29.21 40.89,28.7
+24V  (via drill 0.35)
  Top 0.152: CN1.9 14.66,23.44 13.84,24.26 v13.84,26.42 | v13.84,29.08 13.84,29.97 14.22,30.35 14.22,39.62 15.24,40.64 15.24,45.21
  Top 0.508: U6.6 22.99,43.69 22.23,44.45 21.72,44.45
  Top 0.61: F1.1 13.34,45.21 15.24,45.21 17.65,45.21 | 17.65,45.21 C14.+ | 17.65,45.21 20.95,45.21 21.72,44.45 R16.1
  Bottom 0.152: v13.84,26.42 v13.84,29.08
A_OUT  (via drill 0.35)
  Top 0.152: 58.8,29.21 58.8,27.3
  Top 0.254: C5.2 46.61,24.64
  Top 0.406: 58.8,29.21 58.29,29.72 48.77,29.72 48.39,29.34 48.39,23.88 | 48.39,23.88 48.39,22.61 R2.1 48.13,22.48 47.24,21.59 45.85,21.59 45.34,22.1 45.34,22.99 44.83,23.5 U3.14 | v48.26,23.88 48.39,23.88 | v47.24,24.64 46.61,24.64
  Top 0.508: 58.8,27.3 Q1.3
  Bottom 0.406: v48.26,23.88 48.13,23.88 47.37,24.64 v47.24,24.64
  pour Top (rank 2, no thermals): 58.55,23.24 58.17,22.86 55.5,22.86 55.5,15.37 70.48,15.37 70.48,30.23 60.71,30.23 60.33,29.84 58.17,29.84 58.55,29.46
B_OUT  (via drill 0.35)
  Top 0.406: Q3.3 58.8,12.06 58.8,13.97 58.29,14.48 48.77,14.48 48.39,14.1 48.39,8.64 | 48.26,7.37 48.39,7.37 48.39,8.64 | 48.39,8.64 v48.26,8.64 | v47.24,9.4 46.48,9.4 C8.2 | R6.1 48.26,7.37 | 48.26,7.37 47.24,6.35 45.72,6.35 45.34,6.73 45.34,7.75 44.83,8.26 U4.14
  Bottom 0.406: v48.26,8.64 48.13,8.64 47.37,9.4 v47.24,9.4
  pour Top (rank 3, no thermals): 70.48,14.99 60.71,14.99 60.33,14.61 58.17,14.61 58.55,14.22 58.55,8.13 58.04,7.62 55.5,7.62 55.5,1.52 56.01,1.02 70.48,1.02
CANH
  Top 0.152: U2.7 20.83,27.3 20.57,27.56 11.81,27.56 11.18,26.92 9.03,26.92 CN1.1
CANL
  Top 0.152: U2.6 22.1,27.3 21.46,27.94 CN1.2
CANRX
  Top 0.152: U1.45 25.93,19.03 25.4,19.56 23.62,19.56 23.37,19.81 U2.4
CANTX
  Top 0.152: U1.46 25.43,19.02 25.27,19.18 19.94,19.18 19.56,19.56 U2.1
EN  (via drill 0.35)
  Top 0.152: v33.53,12.19 33.13,12.59 U1.28 | v35.18,14.86 35.94,14.86 36.2,15.11 36.2,20.57 35.81,20.95 U3.5 | U4.5 36.07,5.71 36.45,6.1 36.45,10.92 v35.18,12.19
  Bottom 0.152: v35.18,14.86 v35.18,12.19 v33.53,12.19
ENC_A
  Top 0.152: U1.10 19.85,12.09 CN2.P$3
ENC_B
  Top 0.152: U1.11 21.85,11.59 CN2.P$4
GNDA  (via drill 0.35, 0.4)
  other vias: 51.56,18.03 52.2,18.54 41.66,20.83 41.78,25.15 52.83,19.05 51.56,19.05 51.56,20.07 52.83,20.07 52.83,21.08 51.56,21.08 52.83,22.1 52.83,23.11 51.56,22.1 52.83,18.03 52.2,19.56 52.2,20.57 52.2,21.59 52.2,22.61 50.93,21.59 50.29,21.08 50.29,22.1 50.93,20.57 50.93,19.56 50.29,20.07 49.66,20.57 49.02,20.07 49.02,21.08 49.66,21.59 41.15,11.81 43.81,28.57 39.75,29.97 39.62,3.43 44.7,1.02 42.67,33.27 42.67,36.83 42.67,40.64 42.67,44.45 42.67,48.26 52.83,2.79 51.56,2.79 52.2,3.3 52.83,3.81 51.56,3.81 52.2,4.32 52.2,5.33 52.83,4.83 51.56,4.83 52.83,5.84 51.56,5.84 52.2,6.35 52.83,6.86 52.2,7.37 52.83,7.87 51.56,6.86 41.66,5.59 50.93,5.33 50.93,4.32 50.29,4.83 50.29,5.84 50.93,6.35 50.29,6.86 49.66,6.35 49.66,5.33 49.02,5.84 49.02,4.83 50.93,7.37 49.66,7.37 51.56,7.87 50.29,7.87 45.72,48.26 48.26,48.26 50.8,48.26 53.34,48.26 55.88,48.26 45.72,45.72 48.26,45.72 50.8,45.72 53.34,45.72 53.34,43.18 48.26,40.64 55.88,43.18 45.72,38.1 48.26,38.1 50.8,38.1 53.34,38.1 53.34,35.56 50.8,35.56 48.26,35.56 45.72,35.56 45.72,33.02 48.26,33.02 50.8,33.02 45.72,30.48 45.72,20.32 48.26,20.32 48.26,5.08 45.72,5.08 73.66,10.16 76.2,10.16 78.74,10.16 78.74,12.7 76.2,12.7 73.66,12.7 73.66,15.24 76.2,15.24 78.74,15.24 78.74,17.78 76.2,17.78 73.66,17.78 73.66,20.32 76.2,20.32 78.74,20.32 78.74,22.86 76.2,22.86 73.66,22.86 73.66,25.4 76.2,25.4 78.74,25.4 78.74,27.94 76.2,27.94 73.66,27.94 73.66,30.48 76.2,30.48 78.74,30.48 78.74,33.02 73.66,33.02 76.2,33.02 76.2,35.56 78.74,35.56 78.74,38.1 76.2,38.1 73.66,38.1 73.66,35.56 71.12,40.64 68.58,48.26 66.04,48.26 63.5,48.26 60.96,48.26 58.42,48.26 55.88,45.72 58.42,45.72 60.96,45.72 63.5,45.72 66.04,45.72 68.58,45.72 68.58,43.18 66.04,43.18 63.5,43.18 60.96,43.18 58.42,43.18 58.42,40.64 60.96,40.64 63.5,40.64 66.04,40.64 68.58,40.64 68.58,38.1 71.12,38.1 60.96,38.1 58.42,38.1 55.88,40.64 55.88,38.1 71.12,35.56 71.12,33.02 71.12,30.48 71.12,27.94 71.12,25.4 71.12,22.86 71.12,20.32 71.12,17.78 71.12,15.24 71.12,12.7 71.12,10.16 39.62,0.89 53.85,6.86 52.07,16.13 52.7,1.02 49.53,1.02 43.18,15.24 45.72,15.24 43.18,30.48 48.26,43.18 71.12,48.26 78.74,40.64 71.12,2.54 71.12,7.62 78.74,7.62 53.85,22.1 39.62,26.29 39.62,22.48 39.62,18.67 39.62,14.86 39.62,11.05 39.62,7.24
  pour Top (rank 6, no thermals): 39.24,0 39.24,29.97 42.16,32.89 42.16,49.91 79.88,49.91 79.88,0
  pour Bottom (rank 4, no thermals): 42.16,49.91 79.88,49.91 79.88,0 39.24,0 39.24,29.97 42.16,32.89
GNDIO  (via drill 0.35)
  other vias: 35.69,5.08 28.83,16.51 32.26,10.03 26.29,20.07 20.32,28.96 28.32,19.56 29.08,21.72 22.86,10.03 20.45,11.3 17.02,14.73 24.89,14.1 18.8,19.43 20.83,22.86 29.21,10.92 23.62,17.53 14.61,21.34 18.67,24.77 17.53,21.59 37.21,29.97 39.37,33.27 40.01,36.83 40.01,40.64 40.01,44.45 40.01,48.26 37.21,0.89 2.54,38.1 2.54,35.56 2.54,33.02 5.08,33.02 5.08,30.48 2.54,30.48 2.54,27.94 5.08,27.94 2.54,25.4 2.54,22.86 2.54,20.32 5.08,20.32 10.16,20.32 2.54,17.78 5.08,17.78 5.08,15.24 2.54,15.24 2.54,12.7 2.54,10.16 5.08,10.16 5.08,12.7 7.62,10.16 10.16,7.62 10.16,10.16 10.16,5.08 12.7,5.08 15.24,5.08 17.78,5.08 20.32,5.08 22.86,5.08 22.86,7.62 22.86,2.54 20.32,2.54 17.78,2.54 15.24,2.54 12.7,2.54 10.16,2.54 32.38,1.02 35.81,6.99 35.69,10.54 29.59,13.72 27.18,14.22 21.46,12.83 23.75,22.86 7.62,30.48 7.62,27.94 7.62,33.02 10.16,35.56 2.54,40.64 7.62,40.64 10.16,40.64 10.16,43.18 17.78,40.64 20.32,38.1 20.32,40.64 20.32,35.56 20.32,43.18 22.86,38.1 22.86,35.56 25.4,35.56 27.94,31.88 22.86,33.02 20.32,33.02 17.78,33.02 20.32,30.48 14.73,24.77 33.02,33.02 35.56,33.02 33.02,38.1 35.56,40.64 35.56,43.18 35.56,45.72 27.94,45.72 22.86,48.26 38.1,48.26 20.32,48.26 17.78,48.26 15.24,48.26 12.7,48.26 10.16,48.26 10.16,45.72 38.1,35.56 25.4,38.1 32.64,19.05 34.04,27.56 27.18,23.24 25.27,26.92 13.97,40.64 34.54,29.34 31.88,46.23 27.05,43.94 10.16,25.4 7.62,15.24 10.16,15.24 7.62,17.78 10.16,12.7 21.34,15.24 35.94,14.22 10.16,17.78 15.24,7.62 12.7,7.62 17.78,7.62 20.32,7.62 15.24,31.75 12.7,12.7 18.16,11.43 26.8,16.51 33.53,15.24 29.08,5.59 14.48,16.26 37.21,26.29 37.21,22.48 37.21,18.67 37.21,14.86 37.21,11.05 37.21,7.24 37.21,3.43 30.73,19.81
  pour Bottom (rank 4): 0,49.91 40.51,49.91 40.51,33.78 37.59,30.86 37.59,0 0,0
  pour Top (rank 6): 0,0 0,49.91 40.51,49.91 40.51,33.78 37.59,30.86 37.59,0
LED0  (via drill 0.35)
  Top 0.152: U1.18 26.93,10.92 v26.29,11.56
  Bottom 0.152: R9.1 26.04,11.3 v26.29,11.56
LED1  (via drill 0.35)
  Top 0.152: U1.19 27.43,11.04 v27.43,11.56
  Bottom 0.152: v27.43,11.56 28.07,10.92 R10.1
LED2  (via drill 0.35)
  Top 0.152: v28.57,11.56 27.93,10.91 U1.20
  Bottom 0.152: R11.1 30.1,11.05 29.59,11.56 v28.57,11.56
LED_CAN  (via drill 0.35)
  Top 0.152: U1.2 22.01,16.09 21.84,16.26 21.84,17.65 21.34,18.16 19.43,18.16 19.18,18.41 v18.54,18.41 | v16.26,21.34 17.02,22.1 17.02,24.38 17.78,25.15 v17.78,26.42 | v17.78,29.08 17.78,30.86 15.62,33.02 15.62,34.97 CN1.11
  Bottom 0.152: v18.54,18.41 18.03,18.41 16.26,20.19 v16.26,21.34 | 15.62,34.97 CN1.11 | v17.78,26.42 v17.78,29.08
N$1
  Top 0.254: U3.15 44.83,24.77 45.21,24.38 45.21,23.88 46.23,22.86 R2.2 | R1.1 61.76,30.06 60.96,30.86 59.69,30.86 59.05,30.23 D2.C 48.51,30.23 47.88,29.59 47.88,24.38 47.62,24.13 47.62,23.75 46.48,22.61 R2.2 | 46.35,22.61 R2.2
N$2
  Top 0.254: R5.1 61.98,14.61 60.96,15.62 59.69,15.62 59.05,14.99 D5.C 48.51,14.99 47.88,14.35 47.88,9.14 47.62,8.89 47.62,8.51 46.48,7.37 R6.2 46.35,7.49 45.21,8.64 45.21,9.14 44.83,9.53 U4.15
N$3  (via drill 0.35)
  Top 0.152: D10.A 28.19,5.08 v28.07,5.21
  Bottom 0.152: v28.07,5.21 R10.2
N$4
  Top 0.254: 60.2,28.57 61.72,28.57 61.98,28.32 R1.2 | Q1.4 60.2,28.57 | 60.2,28.57 60.2,30.23 D2.A
N$5
  Top 0.254: D6.C 50.55,3.43 50.16,3.81 48.51,3.81 | 48.51,3.81 R7.1 | 48.51,3.81 46.48,3.81 | 46.48,3.81 R8.2 | 46.48,3.81 45.47,3.81 44.83,3.17 U4.10
N$6  (via drill 0.35)
  Top 0.152: U3.6 v35.56,19.68
  Bottom 0.152: v35.56,19.68 35.56,20.32 35.94,20.7 35.94,22.23 | C10.1 35.94,22.23 | 35.94,22.23 35.94,24.26 R14.2
N$7  (via drill 0.35)
  Top 0.152: D9.A 25.65,4.83 v26.04,5.21
  Bottom 0.152: v26.04,5.21 R9.2
N$8
  Top 0.61: CN1.5 9.4,30.99 10.42,29.97 CN1.4 12.06,29.97 12.83,30.73 12.83,42.16 13.34,42.16 F1.2
N$9  (via drill 0.35)
  Top 0.152: U4.6 35.94,4.45 v36.32,4.06
  Bottom 0.152: v36.32,4.06 35.43,4.06 35.43,3.94 | 35.43,3.94 C11.1 | 35.43,3.94 35.43,1.91 R15.2
N$10
  Top 0.152: U1.6 20.32,14.09 20.14,13.91 X1.3
N$11
  Top 0.254: 48.51,19.05 R3.1 | D3.C 50.13,19.05 48.51,19.05 | U3.10 44.96,18.41 45.59,19.05 46.48,19.05 | R4.2 46.48,19.05 | 46.48,19.05 48.51,19.05
N$12
  Top 0.508: U6.8 21.97,41.15 R16.2 | U6.8 U6.1 | U6.8 U6.7
N$13
  Top 0.254: D5.A 60.2,14.99 60.2,13.34 Q3.4 61.98,13.34 R5.2
N$14
  Top 0.61: U6.2 33.02,42.42 | 33.02,42.42 33.76,42.42 L1.P$1 | D8.C 32.13,38.73 33.02,39.62 33.02,42.42
N$15  (via drill 0.35)
  Top 0.152: U6.3 v28.57,43.69
  Bottom 0.152: v28.57,43.69 28.57,42.29 C15.1
N$16
  Top 0.152: R13.1 11.18,17.78 10.03,18.92 7.75,18.92 SW1.P$1
N$17
  Top 0.305: U6.5 26.29,44.96 26.67,45.34 26.67,47.12 R18.2 R17.1
N$18
  Bottom 0.152: R20.2 15.62,25.99 CN1.10
N$19
  Top 0.152: U1.5 20.97,14.59 20.57,14.99 20.57,15.88 20.14,16.31 X1.1
N$20
  Bottom 0.152: R21.2 15.64,37.55 CN1.12
N$21  (via drill 0.35)
  Top 0.152: D11.A 30.73,4.95 v30.48,5.21
  Bottom 0.152: v30.48,5.21 30.1,5.59 R11.2
N$61
  Top 0.254: Q2.4 50.55,17.14 | 50.55,17.14 48.9,17.14 R3.2 | D3.A 50.55,17.14
N$64
  Top 0.254: Q4.4 50.55,1.91 | 50.55,1.91 D6.A | 50.55,1.91 48.51,1.91 R7.2
N$67
  Top 0.406: D4.C 46.86,13.34 46.48,12.95 C8.1 46.48,11.05 44.58,11.05 44.32,10.79 U4.16
N$73
  Top 0.406: D1.C 46.99,28.45 46.48,27.94 C5.1 46.48,26.54 44.7,26.54 44.2,26.04 U3.16
PWM_A
  Top 0.152: U3.1 35.81,26.04 36.58,25.27 36.58,13.84 36.33,13.59 U1.30
PWM_B
  Top 0.152: U4.1 34.29,10.79 34.29,12.83 34.02,13.09 U1.29
SWCLK
  Top 0.152: U1.37 29.93,19.22 28.32,20.83 28.32,22.1 29.08,22.86 CN3.4
SWDIO  (via drill 0.35)
  Top 0.152: CN3.2 30.35,22.23 29.84,21.72 v29.84,20.7 | U1.34 30.58,15.59 v29.84,14.86
  Bottom 0.152: v29.84,14.86 v29.84,20.7
UART_RX
  Top 0.152: U1.43 26.93,22.6 26.54,22.99 CN3.8
UART_TX
  Top 0.152: U1.42 27.43,22.6 27.81,22.99 CN3.6
VCC  (via drill 0.4)
  Top 0.508: D7.C 49.78,44.07 50.42,43.43 IC5.1
  Top 0.61: C3.+ 55.24,35.56 54.48,36.32 54.48,39.5 52.7,41.27 50.41,41.27 IC5.1
  other vias: 55.88,13.21 55.88,12.32 57.66,11.43 55.88,11.43 54.99,11.43 54.1,11.43 56.77,11.43 56.77,26.67 54.99,12.32 54.1,12.32 54.1,13.21 54.99,13.21 56.77,12.32 56.77,13.21 57.66,13.21 57.66,12.32 54.1,10.54 54.1,9.65 54.99,9.65 54.99,10.54 55.88,10.54 55.88,9.65 56.77,9.65 57.66,9.65 57.66,10.54 56.77,10.54 57.66,28.45 57.66,27.56 57.66,26.67 57.66,25.78 57.66,24.89 56.77,25.78 56.77,24.89 55.88,24.89 55.88,25.78 55.88,26.67 56.77,27.56 56.77,28.45 55.88,28.45 55.88,27.56 54.99,27.56 54.1,27.56 54.1,28.45 54.99,28.45 54.99,26.67 54.99,25.78 54.99,24.89 54.1,24.89 54.1,25.78 54.1,26.67
  pour Top (no thermals): 48.64,14.22 58.29,14.22 58.29,8.13 58.04,7.87 53.72,7.87 52.2,9.4 48.64,9.4
  pour Top (no thermals): 48.77,29.46 58.29,29.46 58.29,23.37 58.04,23.11 53.72,23.11 52.2,24.64 48.77,24.64
  pour Bottom (rank 2, no thermals): 59.44,8.51 53.47,8.51 52.96,9.02 52.96,15.62 53.59,16.26 53.59,23.24 52.96,23.88 52.96,33.91 56.26,37.21 70.1,37.21 70.48,36.83 70.48,19.56

### Text on the board
tNames: alpha | OUT+ | RESET | MD201x | 24, Nov. 2018. designed by yskhara | ENC | OUT-
bNames: VM- | VM+